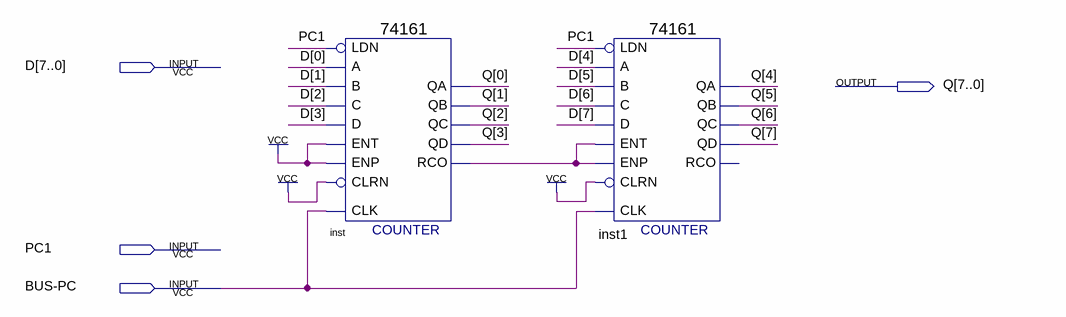
[diagram p0: schematic sheet]
// Quartus schematic PC_conter.bdf as structural Verilog: 2 symbols, 4 pins
module PC_conter (
  input  [7:0] D,
  input  PC1,
  input  \BUS-PC ,
  output [7:0] Q
);

  wire inst_rco;

  \74161  inst (
    .CLRN(1'b1), .CLK(\BUS-PC ), .ENP(1'b1), .LDN(PC1), .A(D[0]), .D(D[3]), .ENT(1'b1), .B(D[1]), .C(D[2]),
    .QD(Q[3]), .QC(Q[2]), .QB(Q[1]), .QA(Q[0]), .RCO(inst_rco));
  \74161  inst1 (
    .CLRN(1'b1), .CLK(\BUS-PC ), .ENP(inst_rco), .LDN(PC1), .A(D[4]), .D(D[7]), .ENT(inst_rco), .B(D[5]),
    .C(D[6]), .QD(Q[7]), .QC(Q[6]), .QB(Q[5]), .QA(Q[4]));  // open: RCO
endmodule
